# EasyEDA schematic WristMountedAvionics.json
TITLE: Sheet_1; REV: 1.0; Date: 2024-07-09; Sheet: 1/1; Company: Your Company
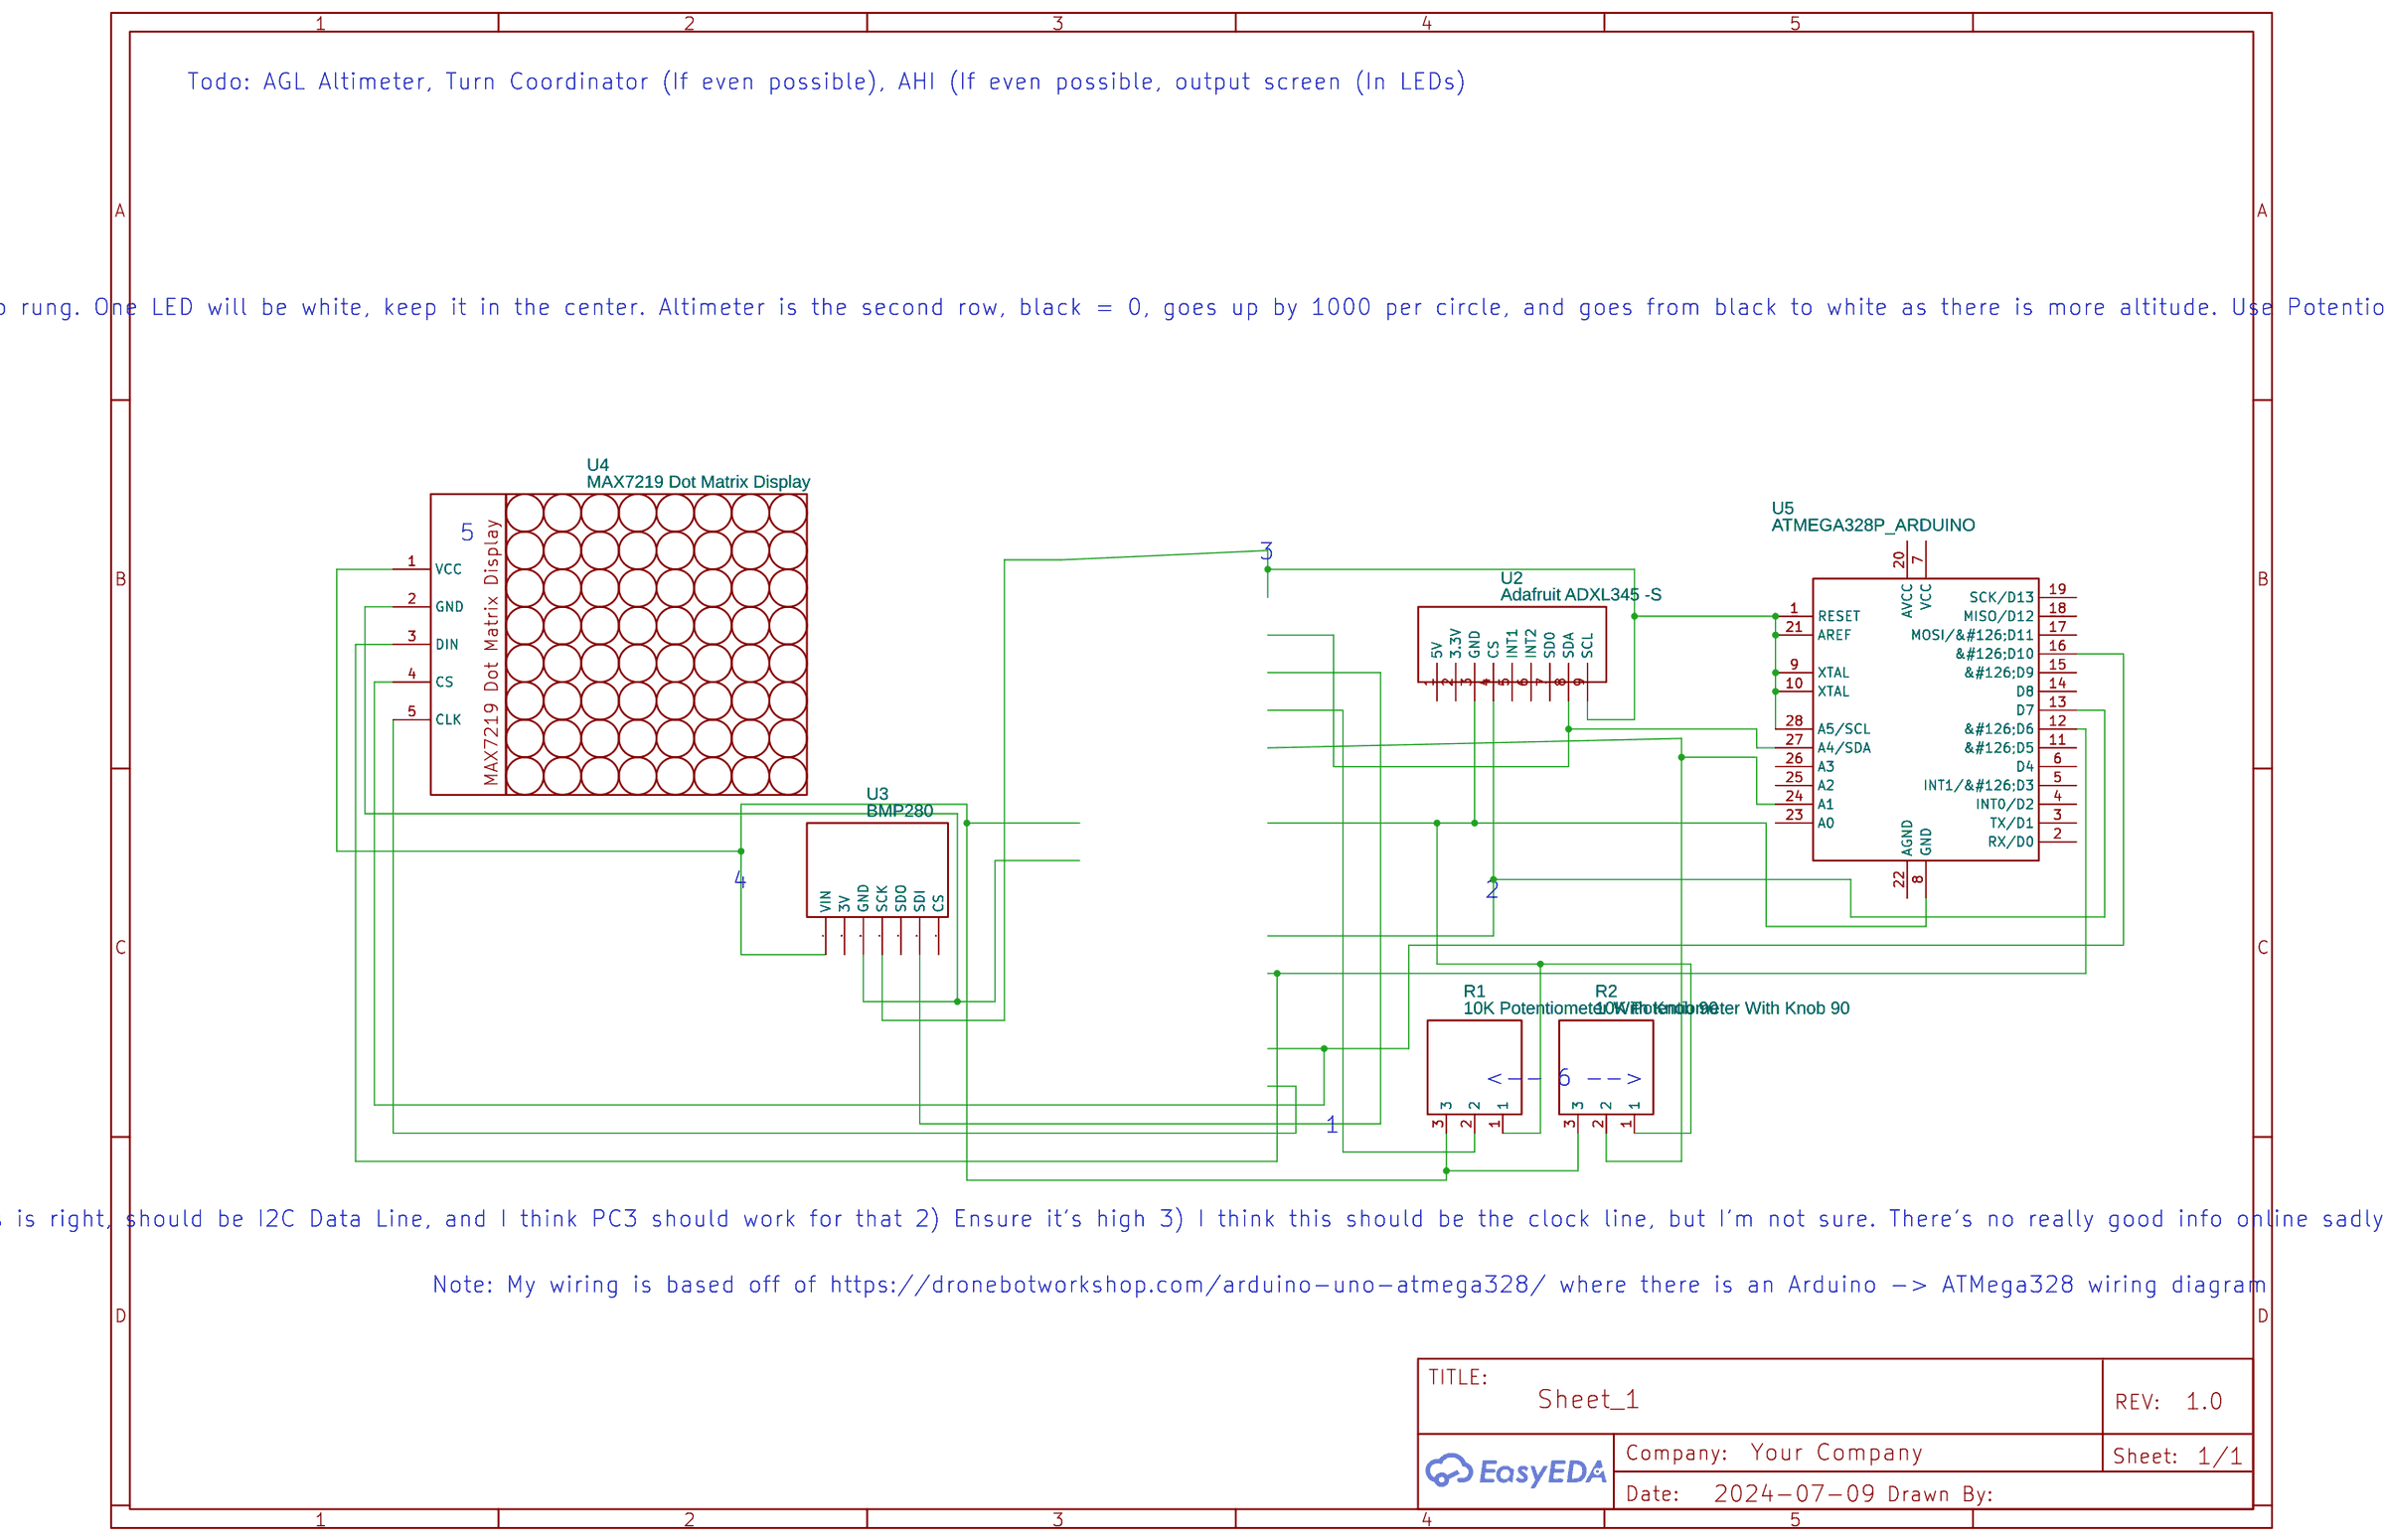
[diagram p0: schematic sheet]

## Parts
R1  10K Potentiometer With Knob 90  [10K-POTENTIOMETER]
R2  10K Potentiometer With Knob 90  [10K-POTENTIOMETER]
U2  Adafruit ADXL345 -S  [ACCELEROMETER_ADAFRUIT ADXL345]
U3  BMP280  [BMP280YSF BMP280YSF BMP280YSF BMP]
U4  MAX7219 Dot Matrix Display  [MAX7219]
U5  ATMEGA328P_ARDUINO  [ATMEGA328P]

## Library data of the parts
R1 R2 = 10K-POTENTIOMETER COPY: Contributor: whitehatgamer
U2 = Adafruit ADXL345 -S: Contributor: benjaminhurst23
U3 = BMP280: Contributor: Calibre320
U4 = MAX7219 Dot Matrix Display: Contributor: Paulo Rogério Gomes Till
U5 = ATMEGA328P_ARDUINO: Contributor: electromaniax

## Nets
Net-(R1-1): R1.1 R2.1 U2.3(GND) U5.8(GND)
Net-(R1-3): R1.3 R2.3 U3.7(VIN) U4.1(VCC)
Net-(R2-2): R2.2 U5.24(A1)
Net-(U2-4): U2.4(CS) U5.13(D7)
Net-(U2-8): U2.8(SDA) U5.27(A4/SDA)
Net-(U2-9): U2.9(SCL) U3.4(SCK) U5.1(RESET) U5.9(XTAL) U5.10(XTAL) U5.21(AREF) U5.28(A5/SCL)
Net-(U3-5): U3.5(GND) U4.2(GND)
Net-(U4-3): U4.3(DIN) U5.12(&#126;D6)
Net-(U4-4): U4.4(CS) U5.16(&#126;D10)

Not connected (* = marked no-connect by the designer): R1 2; U2 1(5V) 2(3.3V) 5(INT1) 6(INT2) 7(SD0); U3 1(CS) 2(SDI) 3(SDO) 6(3V); U4 5(CLK); U5 2(RX/D0) 3(TX/D1) 4(INT0/D2) 5(INT1/&#126;D3) 6(D4) 7(VCC) 11(&#126;D5) 14(D8) 15(&#126;D9) 17(MOSI/&#126;D11) 18(MISO/D12) 19(SCK/D13) 20(AVCC) 22(AGND) 23(A0) 25(A2) 26(A3)

## Notes on the sheet
- Todo: AGL Altimeter, Turn Coordinator (If even possible), AHI (If even possible, output screen (In LEDs)
- 5) Turn Coordinator is the top rung. One LED will be white, keep it in the center. Altimeter is the second row, black = 0, goes up by 1000 per circle, and goes from black to white as there is more altitude. Use Potentiometers to dial in the wind direction and speed, bottom + sign of LEDs is direction, with intensity being brightness. If it is come from say South East, it'd be bright from both the South and East
- 5
- 3
- 4
- 2
- <-- 6 -->
- 1
- 1) I think this is right, should be I2C Data Line, and I think PC3 should work for that 2) Ensure it's high 3) I think this should be the clock line, but I'm not sure. There's no really good info online sadly. 4) I think this is 5v 6) Wiring based off of https://arduinogetstarted.com/tutorials/arduino-potentiometer
- Note: My wiring is based off of https://dronebotworkshop.com/arduino-uno-atmega328/ where there is an Arduino -> ATMega328 wiring diagram
